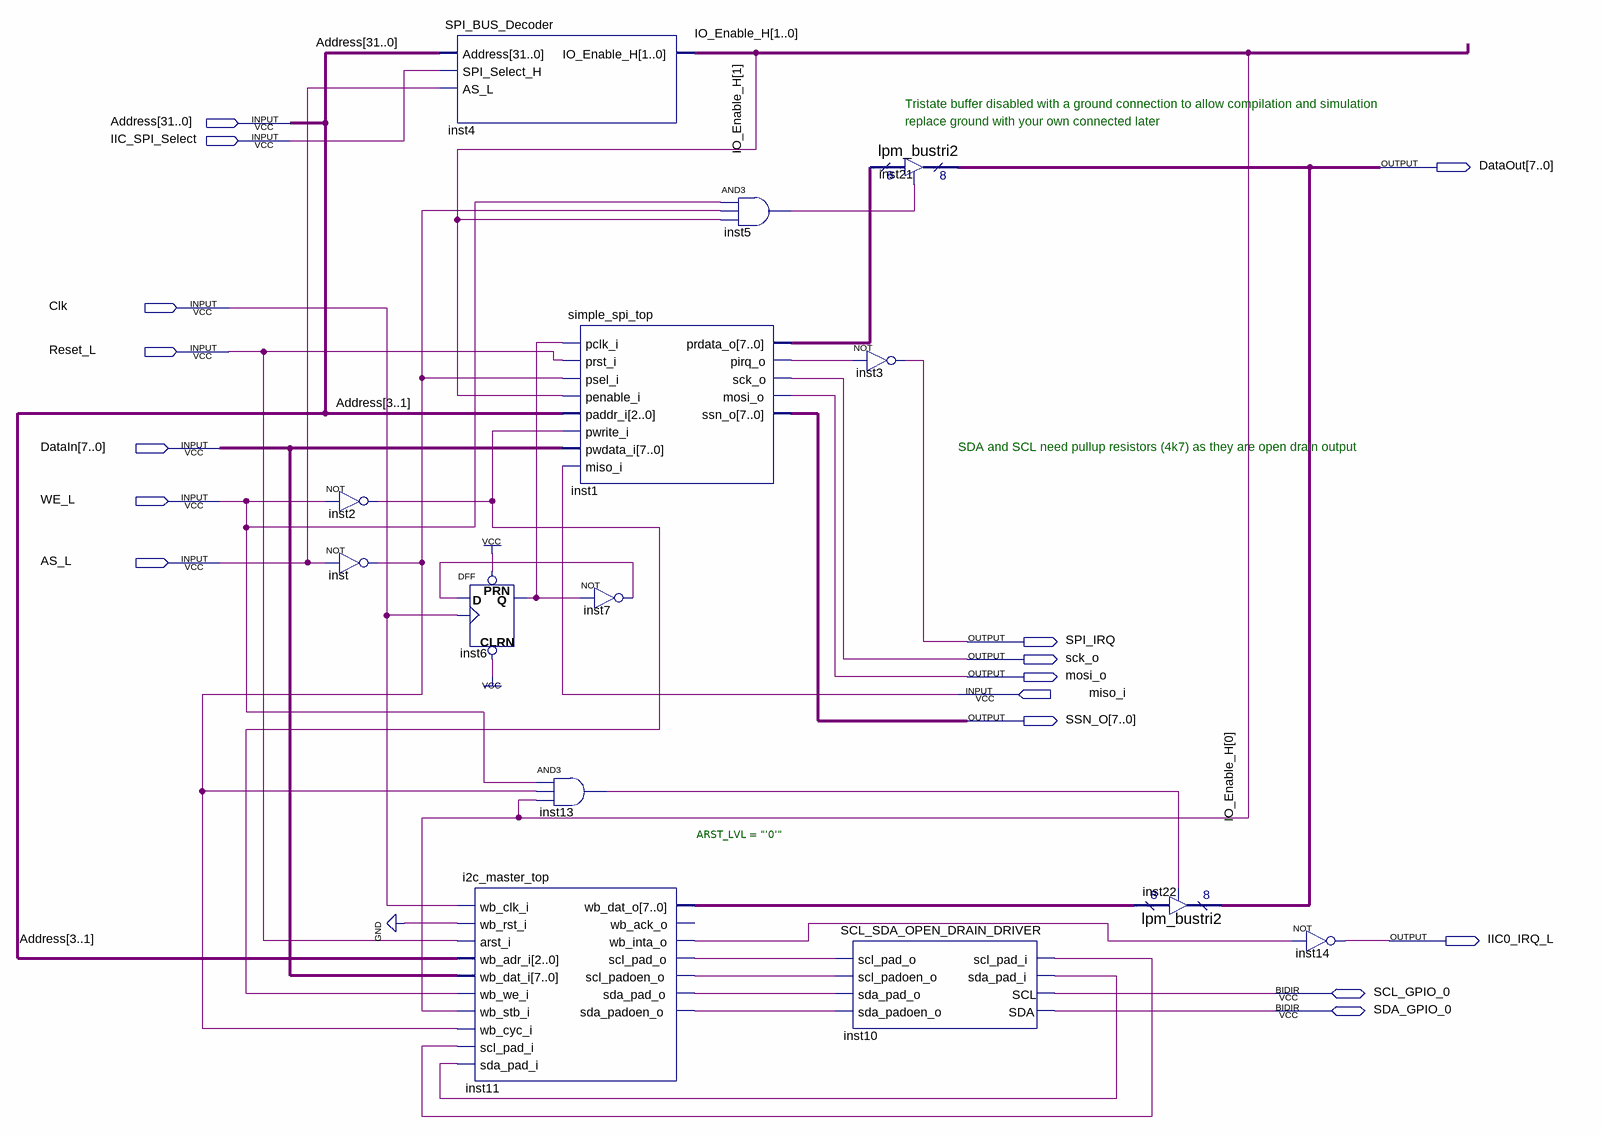
[diagram p0: schematic sheet]
// Quartus schematic IIC_SPI_Interface.bdf as structural Verilog: 14 symbols, 16 pins
module IIC_SPI_Interface (
  input  [31:0] Address,
  input  IIC_SPI_Select,
  input  Clk,
  input  Reset_L,
  input  [7:0] DataIn,
  input  WE_L,
  input  AS_L,
  input  miso_i,
  inout  SCL_GPIO_0,
  inout  SDA_GPIO_0,
  output [7:0] DataOut,
  output SPI_IRQ,
  output sck_o,
  output mosi_o,
  output [7:0] SSN_O,
  output IIC0_IRQ_L
);

  wire inst1_pirq_o, inst2_out, inst5_out, inst6_q, inst7_out, inst10_scl_pad_i, inst10_sda_pad_i,
       inst11_scl_pad_o, inst11_scl_padoen_o, inst11_sda_pad_o, inst11_sda_padoen_o, inst11_wb_inta_o,
       inst13_out, inst_out;
  wire [1:0] IO_Enable_H;
  wire [7:0] inst1_prdata_o, inst11_wb_dat_o;

  not inst2 (inst2_out, WE_L);
  not inst (inst_out, AS_L);
  SPI_BUS_Decoder inst4 (.Address(Address), .SPI_Select_H(IIC_SPI_Select), .AS_L(AS_L), .IO_Enable_H(IO_Enable_H));
  DFF inst6 (.CLRN(1'b1), .CLK(Clk), .D(inst7_out), .PRN(1'b1), .Q(inst6_q));
  i2c_master_top #(.ARST_LVL("'0'")) inst11 (
    .wb_clk_i(Clk), .wb_rst_i(1'b0), .arst_i(Reset_L), .wb_adr_i(Address[3:1]), .wb_dat_i(DataIn),
    .wb_we_i(inst2_out), .wb_stb_i(IO_Enable_H[0]), .wb_cyc_i(inst_out), .scl_pad_i(inst10_scl_pad_i),
    .sda_pad_i(inst10_sda_pad_i), .wb_dat_o(inst11_wb_dat_o), .wb_inta_o(inst11_wb_inta_o),
    .scl_pad_o(inst11_scl_pad_o), .scl_padoen_o(inst11_scl_padoen_o), .sda_pad_o(inst11_sda_pad_o),
    .sda_padoen_o(inst11_sda_padoen_o));  // open: wb_ack_o
  simple_spi_top inst1 (
    .pclk_i(inst6_q), .prst_i(Reset_L), .psel_i(inst_out), .penable_i(IO_Enable_H[1]),
    .paddr_i(Address[3:1]), .pwrite_i(inst2_out), .pwdata_i(DataIn), .miso_i(miso_i),
    .prdata_o(inst1_prdata_o), .pirq_o(inst1_pirq_o), .sck_o(sck_o), .mosi_o(mosi_o), .ssn_o(SSN_O));
  not inst7 (inst7_out, inst6_q);
  and inst13 (inst13_out, WE_L, inst_out, IO_Enable_H[0]);
  and inst5 (inst5_out, WE_L, inst_out, IO_Enable_H[1]);
  lpm_bustri2 inst21 (.enabledt(inst5_out), .data(inst1_prdata_o), .tridata(DataOut));
  not inst3 (SPI_IRQ, inst1_pirq_o);
  SCL_SDA_OPEN_DRAIN_DRIVER inst10 (
    .scl_pad_o(inst11_scl_pad_o), .scl_padoen_o(inst11_scl_padoen_o), .sda_pad_o(inst11_sda_pad_o),
    .sda_padoen_o(inst11_sda_padoen_o), .scl_pad_i(inst10_scl_pad_i), .sda_pad_i(inst10_sda_pad_i),
    .SCL(SCL_GPIO_0), .SDA(SDA_GPIO_0));
  lpm_bustri2 inst22 (.enabledt(inst13_out), .data(inst11_wb_dat_o), .tridata(DataOut));
  not inst14 (IIC0_IRQ_L, inst11_wb_inta_o);

  // Notes on the sheet:
  //   Tristate buffer disabled with a ground connection to allow compilation and simulation
  //   replace ground with your own connected later
  //   SDA and SCL need pullup resistors (4k7) as they are open drain output
endmodule
